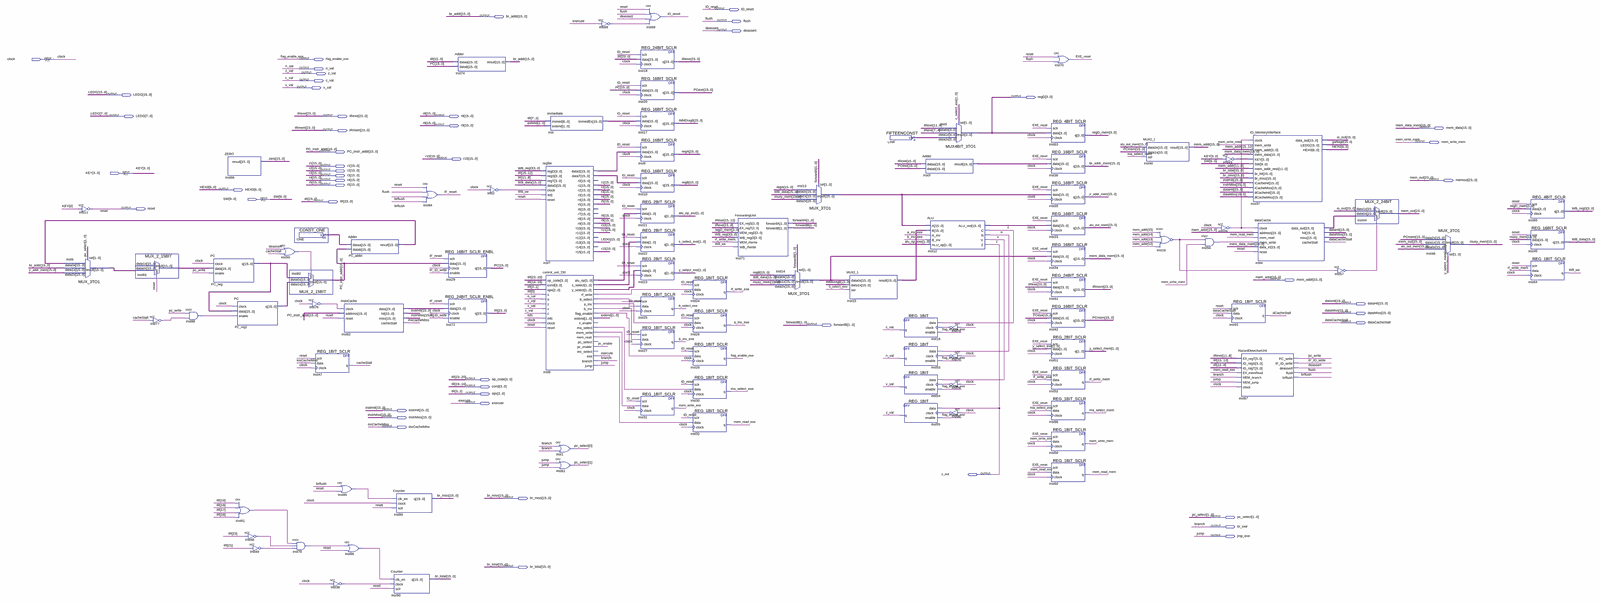
[diagram p0: schematic sheet, whole]
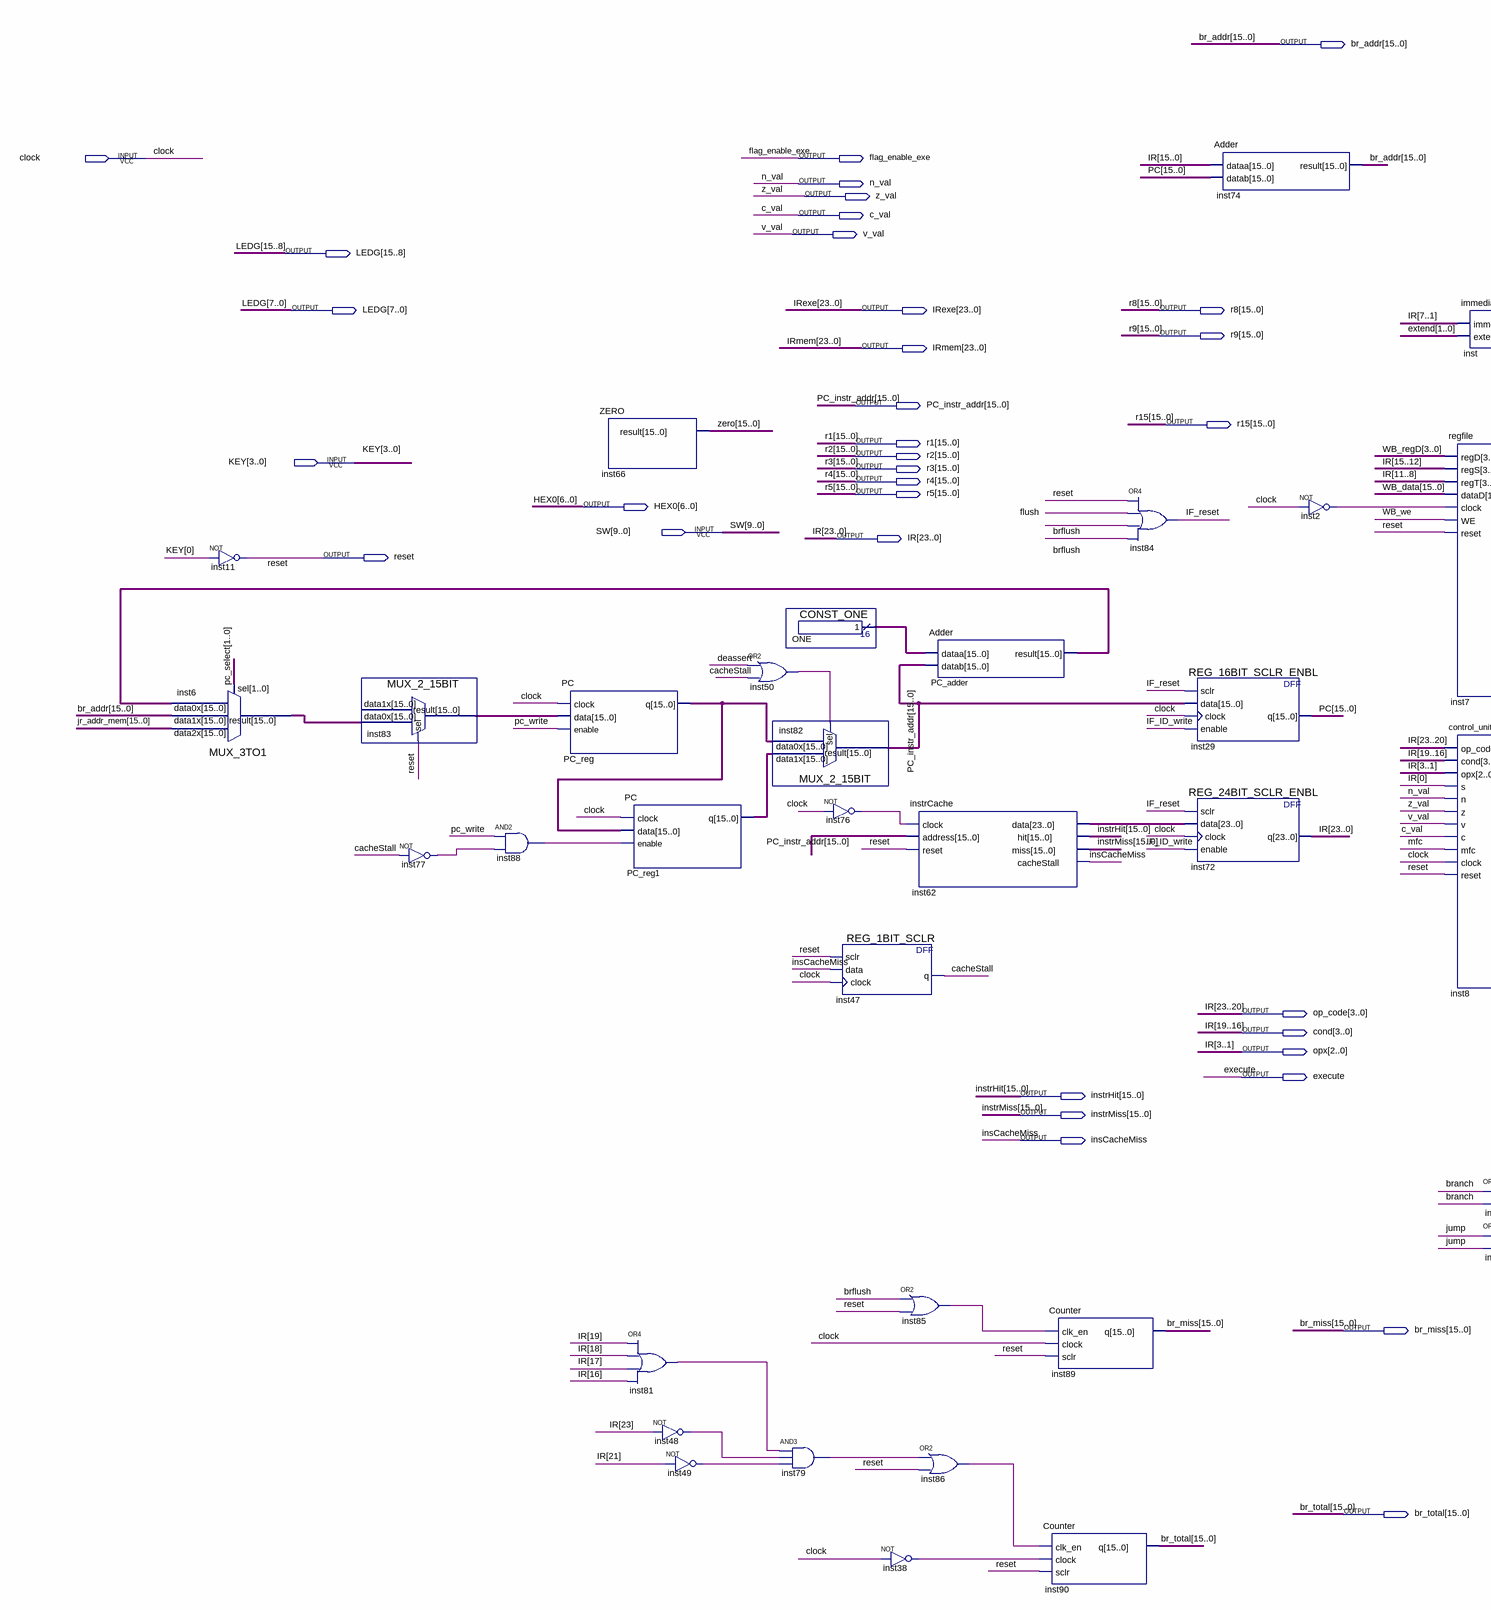
[diagram p1: schematic sheet, left part]
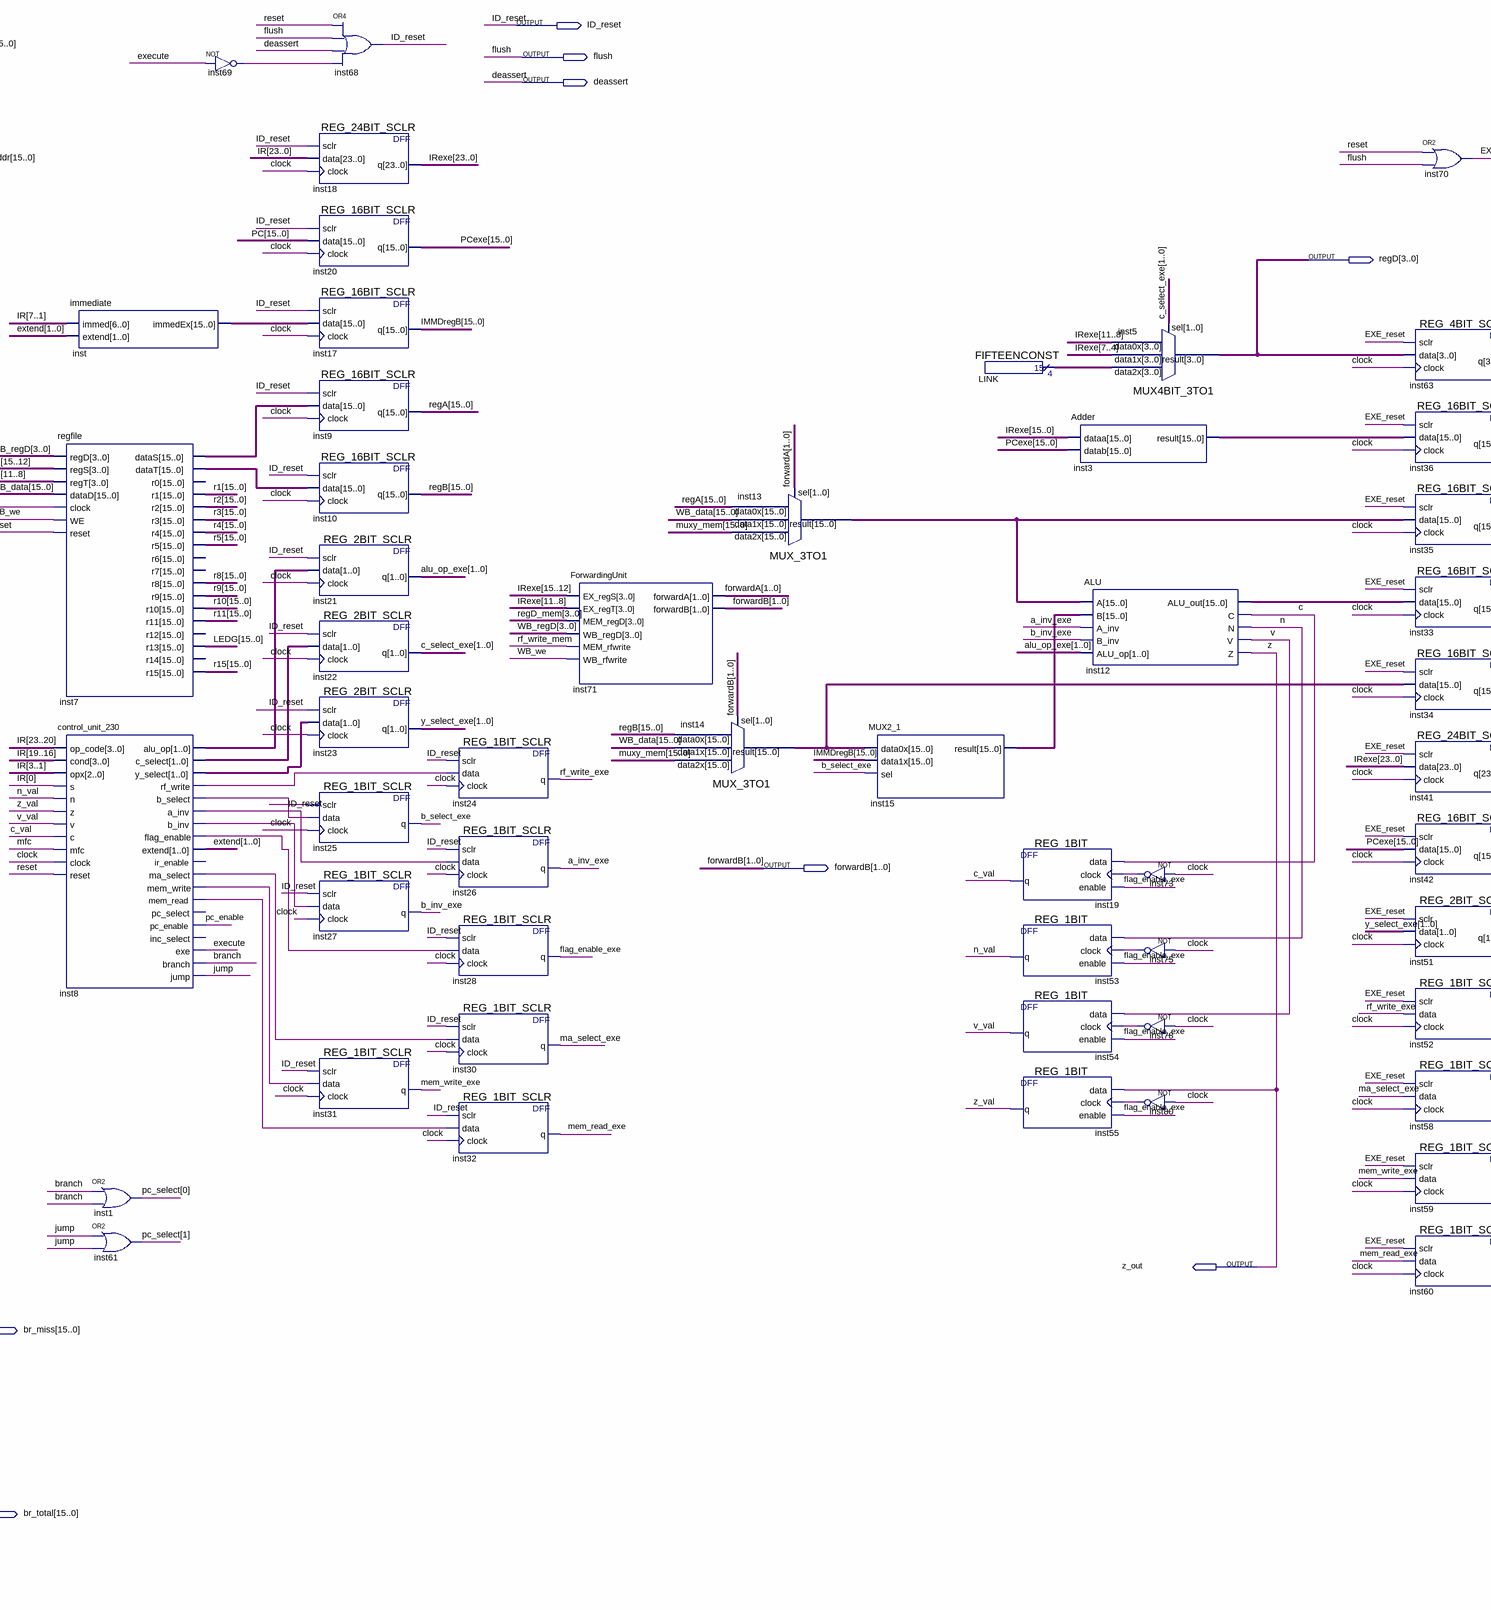
[diagram p2: schematic sheet, centre part]
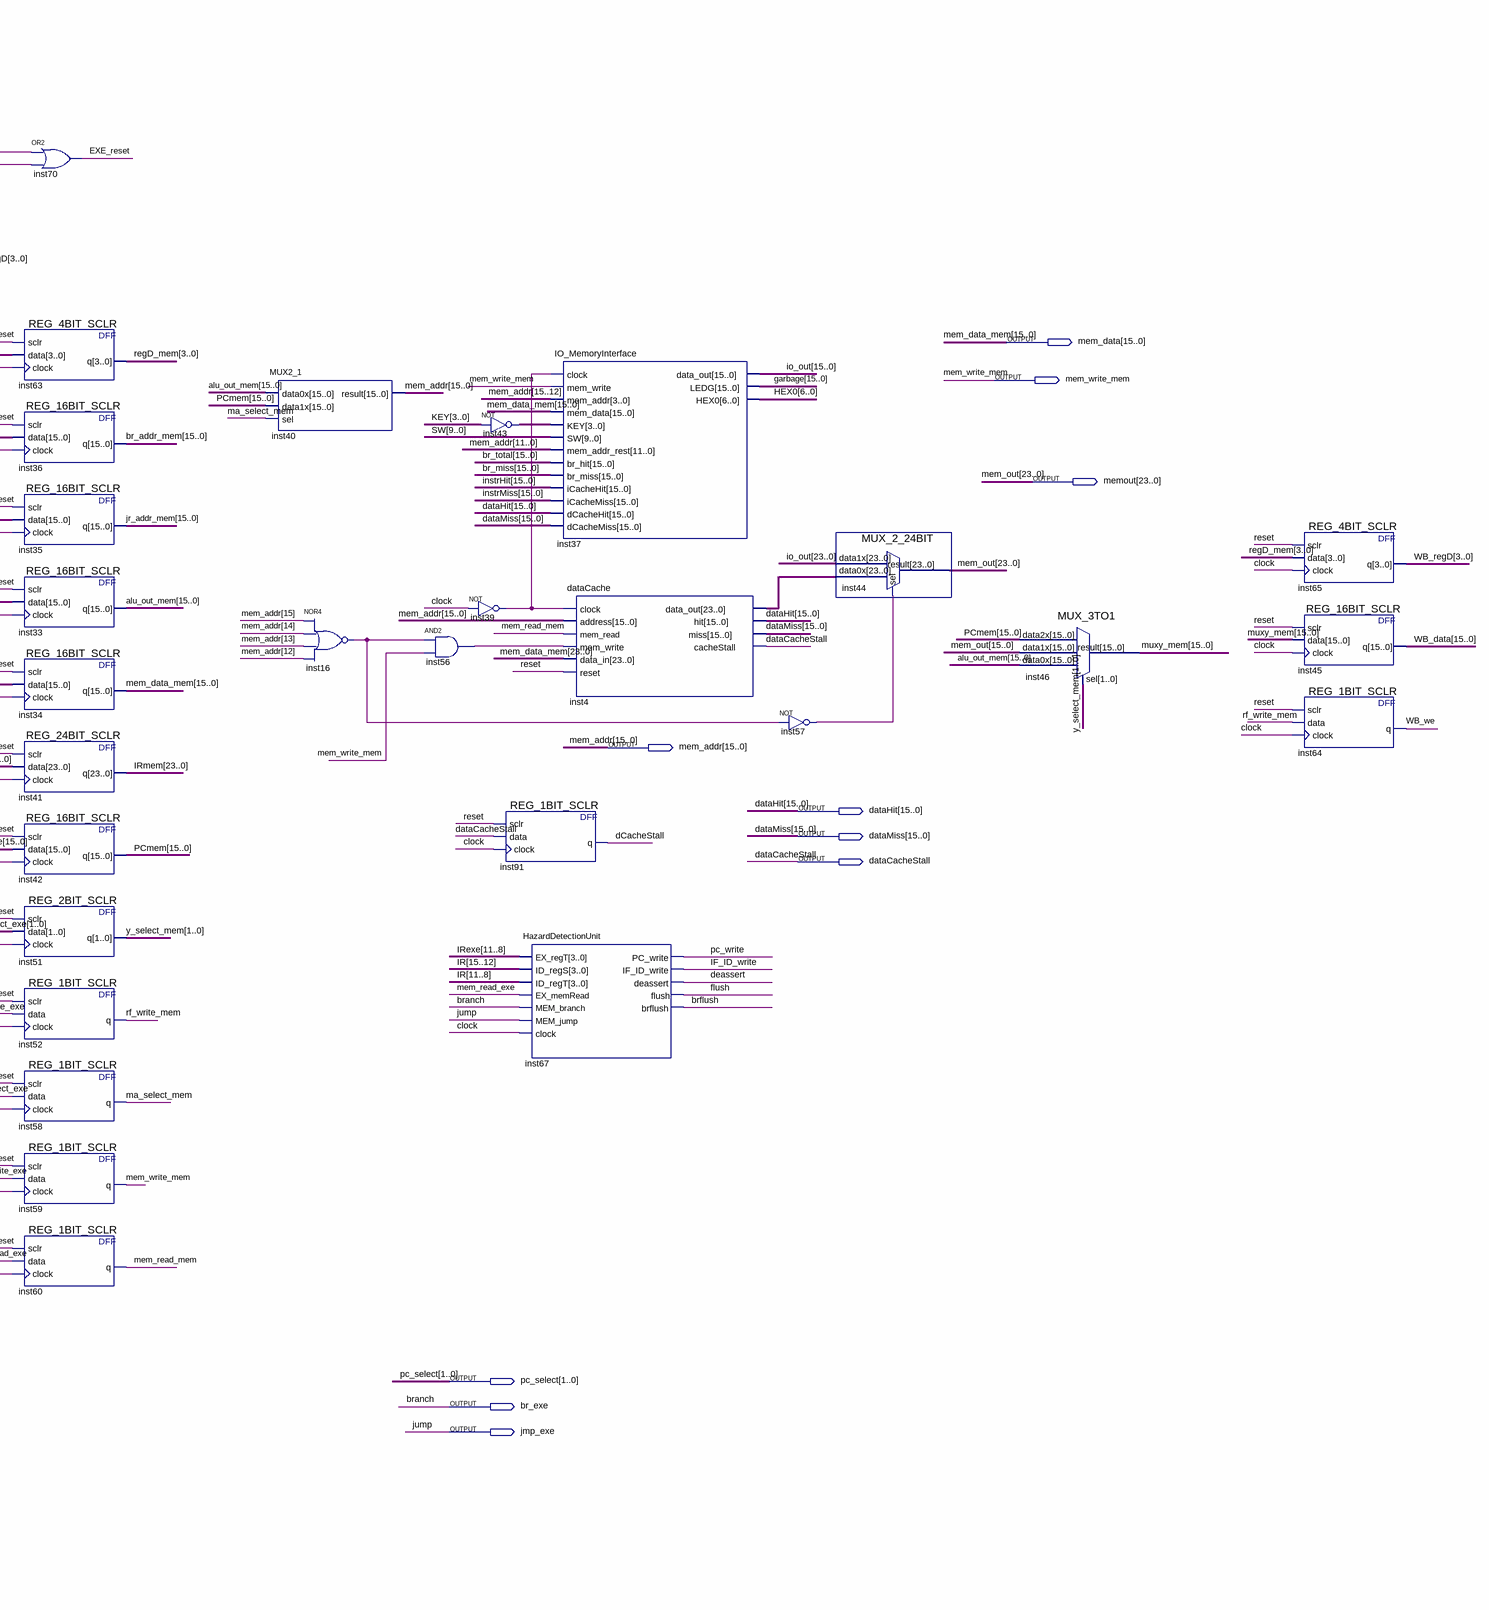
[diagram p3: schematic sheet, right part]
// Quartus schematic processor.bdf as structural Verilog: 96 symbols, 50 pins
module processor (
  input  clock,
  input  [3:0] KEY,
  input  [9:0] SW,
  output ID_reset,
  output [15:0] br_addr,
  output flush,
  output deassert,
  output flag_enable_exe,
  output n_val,
  output z_val,
  output c_val,
  output v_val,
  output [15:0] LEDG,
  output [3:0] regD,
  output [23:0] IRexe,
  output [15:0] r8,
  output [15:0] r9,
  output [15:0] mem_data,
  output [23:0] IRmem,
  output mem_write_mem,
  output [15:0] PC_instr_addr,
  output [15:0] r15,
  output [15:0] r1,
  output [15:0] r2,
  output [15:0] r3,
  output [15:0] r4,
  output [23:0] memout,
  output [15:0] r5,
  output [6:0] HEX0,
  output [23:0] IR,
  output reset,
  output [15:0] mem_addr,
  output [15:0] dataHit,
  output [15:0] dataMiss,
  output dataCacheStall,
  output [1:0] forwardB,
  output [3:0] op_code,
  output [3:0] cond,
  output [2:0] opx,
  output execute,
  output [15:0] instrHit,
  output [15:0] instrMiss,
  output insCacheMiss,
  output z_out,
  output [15:0] br_miss,
  output [1:0] pc_select,
  output br_exe,
  output jmp_exe,
  output [15:0] br_total
);

  wire a_inv_exe, b_inv_exe, b_select_exe, brflush, c, cacheStall, dCacheStall, EXE_reset, IF_ID_write,
       IF_reset, inst2_out, inst8_a_inv, inst8_b_inv, inst8_b_select, inst8_flag_enable, inst8_ma_select,
       inst8_mem_read, inst8_mem_write, inst8_rf_write, inst16_out, inst38_out, inst39_out, inst48_out,
       inst49_out, inst50_out, inst56_out, inst57_out, inst69_out, inst73_out, inst75_out, inst76_out,
       inst77_out, inst78_out, inst79_out, inst80_out, inst81_out, inst85_out, inst86_out, inst88_out,
       ma_select_exe, ma_select_mem, mem_read_exe, mem_read_mem, mem_write_exe, mfc, n, pc_enable, pc_write,
       rf_write_exe, rf_write_mem, v, WB_we;
  wire [1:0] alu_op_exe, c_select_exe, extend, forwardA, inst8_alu_op, inst8_c_select, inst8_y_select,
       y_select_exe, y_select_mem;
  wire [3:0] inst43_out, LINK_result, regD_mem, WB_regD;
  wire [15:0] alu_out_mem, br_addr_mem, garbage, IMMDregB, inst3_result, inst6_result, inst7_datas,
       inst7_datat, inst12_alu_out, inst13_result, inst14_result, inst15_result, inst83_result, inst_immedex,
       jr_addr_mem, muxy_mem, ONE_result, PC, PC_adder_result, PC_reg1_q, PC_reg_q, PCexe, PCmem, r10, r11,
       regA, regB, WB_data, zero;
  wire [23:0] inst4_data_out, inst62_data, io_out;
  wire [23:16] mem_data_mem;

  MUX_3TO1 inst6 (
    .data2x(jr_addr_mem), .data1x(br_addr), .data0x(PC_adder_result), .sel(pc_select), .result(inst6_result));
  not inst11 (reset, KEY[0]);
  MUX_2_15BIT inst83 (.data0x(inst6_result), .sel(reset), .result(inst83_result));  // open: data1x
  not inst77 (inst77_out, cacheStall);
  and inst88 (inst88_out, pc_write, inst77_out);
  ZERO inst66 (.result(zero));
  PC PC_reg (.clock(clock), .data(inst83_result), .enable(pc_write), .q(PC_reg_q));
  PC PC_reg1 (.clock(clock), .data(PC_reg_q), .enable(inst88_out), .q(PC_reg1_q));
  or inst81 (inst81_out, cond[3], cond[2], cond[1], cond[0]);
  not inst48 (inst48_out, IR[23]);
  not inst49 (inst49_out, IR[21]);
  or inst50 (inst50_out, deassert, cacheStall);
  CONST_ONE ONE (.result(ONE_result));
  MUX_2_15BIT inst82 (.data1x(PC_reg1_q), .data0x(PC_reg_q), .sel(inst50_out), .result(PC_instr_addr));
  and inst79 (inst79_out, inst81_out, inst48_out, inst49_out);
  not inst76 (inst76_out, clock);
  REG_1BIT_SCLR inst47 (.sclr(reset), .data(insCacheMiss), .clock(clock), .q(cacheStall));
  or inst85 (inst85_out, brflush, reset);
  not inst38 (inst38_out, clock);
  Adder PC_adder (.dataa(ONE_result), .datab(PC_instr_addr), .result(PC_adder_result));
  instrCache inst62 (
    .clock(inst76_out), .address(PC_instr_addr), .reset(reset), .data(inst62_data), .hit(instrHit),
    .miss(instrMiss), .cacheStall(insCacheMiss));
  or inst86 (inst86_out, inst79_out, reset);
  Counter inst89 (.clk_en(inst85_out), .clock(clock), .sclr(reset), .q(br_miss));
  Counter inst90 (.clk_en(inst86_out), .clock(inst38_out), .sclr(reset), .q(br_total));
  or inst84 (IF_reset, reset, flush, brflush, brflush);
  REG_16BIT_SCLR_ENBL inst29 (.sclr(IF_reset), .data(PC_instr_addr), .clock(clock), .enable(IF_ID_write), .q(PC));
  REG_24BIT_SCLR_ENBL inst72 (
    .sclr(IF_reset), .data(inst62_data), .clock(clock), .enable(IF_ID_write), .q({IR[23:20], cond, IR[15:0]}));
  Adder inst74 (.dataa(IR[15:0]), .datab(PC), .result(br_addr));
  not inst2 (inst2_out, clock);
  immediate inst (.immed(IR[7:1]), .extend(extend), .immedEx(inst_immedex));
  regfile inst7 (
    .regD(WB_regD), .regS(IR[15:12]), .regT(IR[11:8]), .dataD(WB_data), .clock(inst2_out), .WE(WB_we),
    .reset(reset), .dataS(inst7_datas), .dataT(inst7_datat), .r1(r1), .r2(r2), .r3(r3), .r4(r4), .r5(r5),
    .r8(r8), .r9(r9), .r10(r10), .r11(r11), .r13(LEDG), .r15(r15));  // open: r0, r6, r7, r12, r14
  control_unit_230 inst8 (
    .op_code(IR[23:20]), .cond(cond), .opx(IR[3:1]), .s(IR[0]), .n(n_val), .z(z_val), .v(v_val), .c(c_val),
    .mfc(mfc), .clock(clock), .reset(reset), .alu_op(inst8_alu_op), .c_select(inst8_c_select),
    .y_select(inst8_y_select), .rf_write(inst8_rf_write), .b_select(inst8_b_select), .a_inv(inst8_a_inv),
    .b_inv(inst8_b_inv), .flag_enable(inst8_flag_enable), .extend(extend), .ma_select(inst8_ma_select),
    .mem_write(inst8_mem_write), .mem_read(inst8_mem_read), .pc_enable(pc_enable), .exe(execute),
    .branch(br_exe), .jump(jmp_exe));  // open: ir_enable, pc_select, inc_select
  or inst1 (pc_select[0], br_exe, br_exe);
  or inst61 (pc_select[1], jmp_exe, jmp_exe);
  not inst69 (inst69_out, execute);
  REG_24BIT_SCLR inst18 (.sclr(ID_reset), .data({IR[23:20], cond, IR[15:0]}), .clock(clock), .q(IRexe));
  REG_16BIT_SCLR inst20 (.sclr(ID_reset), .data(PC), .clock(clock), .q(PCexe));
  REG_16BIT_SCLR inst17 (.sclr(ID_reset), .data(inst_immedex), .clock(clock), .q(IMMDregB));
  REG_16BIT_SCLR inst9 (.sclr(ID_reset), .data(inst7_datas), .clock(clock), .q(regA));
  REG_16BIT_SCLR inst10 (.sclr(ID_reset), .data(inst7_datat), .clock(clock), .q(regB));
  REG_2BIT_SCLR inst21 (.sclr(ID_reset), .data(inst8_alu_op), .clock(clock), .q(alu_op_exe));
  REG_2BIT_SCLR inst22 (.sclr(ID_reset), .data(inst8_c_select), .clock(clock), .q(c_select_exe));
  REG_2BIT_SCLR inst23 (.sclr(ID_reset), .data(inst8_y_select), .clock(clock), .q(y_select_exe));
  REG_1BIT_SCLR inst25 (.sclr(ID_reset), .data(inst8_b_select), .clock(clock), .q(b_select_exe));
  REG_1BIT_SCLR inst27 (.sclr(ID_reset), .data(inst8_b_inv), .clock(clock), .q(b_inv_exe));
  REG_1BIT_SCLR inst31 (.sclr(ID_reset), .data(inst8_mem_write), .clock(clock), .q(mem_write_exe));
  or inst68 (ID_reset, reset, flush, deassert, inst69_out);
  REG_1BIT_SCLR inst24 (.sclr(ID_reset), .data(inst8_rf_write), .clock(clock), .q(rf_write_exe));
  REG_1BIT_SCLR inst26 (.sclr(ID_reset), .data(inst8_a_inv), .clock(clock), .q(a_inv_exe));
  REG_1BIT_SCLR inst28 (.sclr(ID_reset), .data(inst8_flag_enable), .clock(clock), .q(flag_enable_exe));
  REG_1BIT_SCLR inst30 (.sclr(ID_reset), .data(inst8_ma_select), .clock(clock), .q(ma_select_exe));
  REG_1BIT_SCLR inst32 (.sclr(ID_reset), .data(inst8_mem_read), .clock(clock), .q(mem_read_exe));
  ForwardingUnit inst71 (
    .EX_regS(IRexe[15:12]), .EX_regT(IRexe[11:8]), .MEM_regD(regD_mem), .WB_regD(WB_regD),
    .MEM_rfwrite(rf_write_mem), .WB_rfwrite(WB_we), .forwardA(forwardA), .forwardB(forwardB));
  MUX_3TO1 inst14 (.data2x(muxy_mem), .data1x(WB_data), .data0x(regB), .sel(forwardB), .result(inst14_result));
  MUX_3TO1 inst13 (.data2x(muxy_mem), .data1x(WB_data), .data0x(regA), .sel(forwardA), .result(inst13_result));
  MUX2_1 inst15 (.data0x(inst14_result), .data1x(IMMDregB), .sel(b_select_exe), .result(inst15_result));
  FIFTEENCONST LINK (.result(LINK_result));
  REG_1BIT inst19 (.data(c), .clock(inst73_out), .enable(flag_enable_exe), .q(c_val));
  REG_1BIT inst53 (.data(n), .clock(inst75_out), .enable(flag_enable_exe), .q(n_val));
  REG_1BIT inst54 (.data(v), .clock(inst78_out), .enable(flag_enable_exe), .q(v_val));
  REG_1BIT inst55 (.data(z_out), .clock(inst80_out), .enable(flag_enable_exe), .q(z_val));
  Adder inst3 (.dataa(IRexe[15:0]), .datab(PCexe), .result(inst3_result));
  ALU inst12 (
    .A(inst13_result), .B(inst15_result), .A_inv(a_inv_exe), .B_inv(b_inv_exe), .ALU_op(alu_op_exe),
    .ALU_out(inst12_alu_out), .C(c), .N(n), .V(v), .Z(z_out));
  MUX4BIT_3TO1 inst5 (
    .data2x(LINK_result), .data1x(IRexe[7:4]), .data0x(IRexe[11:8]), .sel(c_select_exe), .result(regD));
  not inst73 (inst73_out, clock);
  not inst75 (inst75_out, clock);
  not inst78 (inst78_out, clock);
  not inst80 (inst80_out, clock);
  or inst70 (EXE_reset, reset, flush);
  REG_4BIT_SCLR inst63 (.sclr(EXE_reset), .data(regD), .clock(clock), .q(regD_mem));
  REG_16BIT_SCLR inst36 (.sclr(EXE_reset), .data(inst3_result), .clock(clock), .q(br_addr_mem));
  REG_16BIT_SCLR inst35 (.sclr(EXE_reset), .data(inst13_result), .clock(clock), .q(jr_addr_mem));
  REG_16BIT_SCLR inst33 (.sclr(EXE_reset), .data(inst12_alu_out), .clock(clock), .q(alu_out_mem));
  REG_16BIT_SCLR inst34 (.sclr(EXE_reset), .data(inst14_result), .clock(clock), .q(mem_data));
  REG_24BIT_SCLR inst41 (.sclr(EXE_reset), .data(IRexe), .clock(clock), .q(IRmem));
  REG_16BIT_SCLR inst42 (.sclr(EXE_reset), .data(PCexe), .clock(clock), .q(PCmem));
  REG_2BIT_SCLR inst51 (.sclr(EXE_reset), .data(y_select_exe), .clock(clock), .q(y_select_mem));
  REG_1BIT_SCLR inst52 (.sclr(EXE_reset), .data(rf_write_exe), .clock(clock), .q(rf_write_mem));
  REG_1BIT_SCLR inst58 (.sclr(EXE_reset), .data(ma_select_exe), .clock(clock), .q(ma_select_mem));
  REG_1BIT_SCLR inst59 (.sclr(EXE_reset), .data(mem_write_exe), .clock(clock), .q(mem_write_mem));
  REG_1BIT_SCLR inst60 (.sclr(EXE_reset), .data(mem_read_exe), .clock(clock), .q(mem_read_mem));
  MUX2_1 inst40 (.data0x(alu_out_mem), .data1x(PCmem), .sel(ma_select_mem), .result(mem_addr));
  nor inst16 (inst16_out, mem_addr[15], mem_addr[14], mem_addr[13], mem_addr[12]);
  and inst56 (inst56_out, inst16_out, mem_write_mem);
  assign inst43_out = ~KEY;  // NOT inst43, 4 bits wide
  not inst39 (inst39_out, clock);
  REG_1BIT_SCLR inst91 (.sclr(reset), .data(dataCacheStall), .clock(clock), .q(dCacheStall));
  IO_MemoryInterface inst37 (
    .clock(inst39_out), .mem_write(mem_write_mem), .mem_addr(mem_addr[15:12]), .mem_data(mem_data),
    .KEY(inst43_out), .SW(SW), .mem_addr_rest(mem_addr[11:0]), .br_hit(br_total), .br_miss(br_miss),
    .iCacheHit(instrHit), .iCacheMiss(instrMiss), .dCacheHit(dataHit), .dCacheMiss(dataMiss),
    .data_out(io_out[15:0]), .LEDG(garbage), .HEX0(HEX0));
  HazardDetectionUnit inst67 (
    .EX_regT(IRexe[11:8]), .ID_regS(IR[15:12]), .ID_regT(IR[11:8]), .EX_memRead(mem_read_exe),
    .MEM_branch(br_exe), .MEM_jump(jmp_exe), .clock(clock), .PC_write(pc_write), .IF_ID_write(IF_ID_write),
    .deassert(deassert), .flush(flush), .brflush(brflush));
  dataCache inst4 (
    .clock(inst39_out), .address(mem_addr), .mem_read(mem_read_mem), .mem_write(inst56_out),
    .data_in({mem_data_mem, mem_data}), .reset(reset), .data_out(inst4_data_out), .hit(dataHit),
    .miss(dataMiss), .cacheStall(dataCacheStall));
  not inst57 (inst57_out, inst16_out);
  MUX_2_24BIT inst44 (.data1x(io_out), .data0x(inst4_data_out), .sel(inst57_out), .result(memout));
  MUX_3TO1 inst46 (.data2x(PCmem), .data1x(memout[15:0]), .data0x(alu_out_mem), .sel(y_select_mem), .result(muxy_mem));
  REG_4BIT_SCLR inst65 (.sclr(reset), .data(regD_mem), .clock(clock), .q(WB_regD));
  REG_16BIT_SCLR inst45 (.sclr(reset), .data(muxy_mem), .clock(clock), .q(WB_data));
  REG_1BIT_SCLR inst64 (.sclr(reset), .data(rf_write_mem), .clock(clock), .q(WB_we));

  assign IR[19:16] = cond;
  assign op_code = IR[23:20];
  assign opx = IR[3:1];

  // Other names for the same wires on the sheet: branch = br_exe; jump = jmp_exe; mem_data_mem[15:0] = mem_data;
  //   mem_out[23:0] = memout; z = z_out
endmodule
